# Altium schematic sheet I2C_BUS.SchDoc
size A4; SheetNumber: 2; SheetTotal: 3
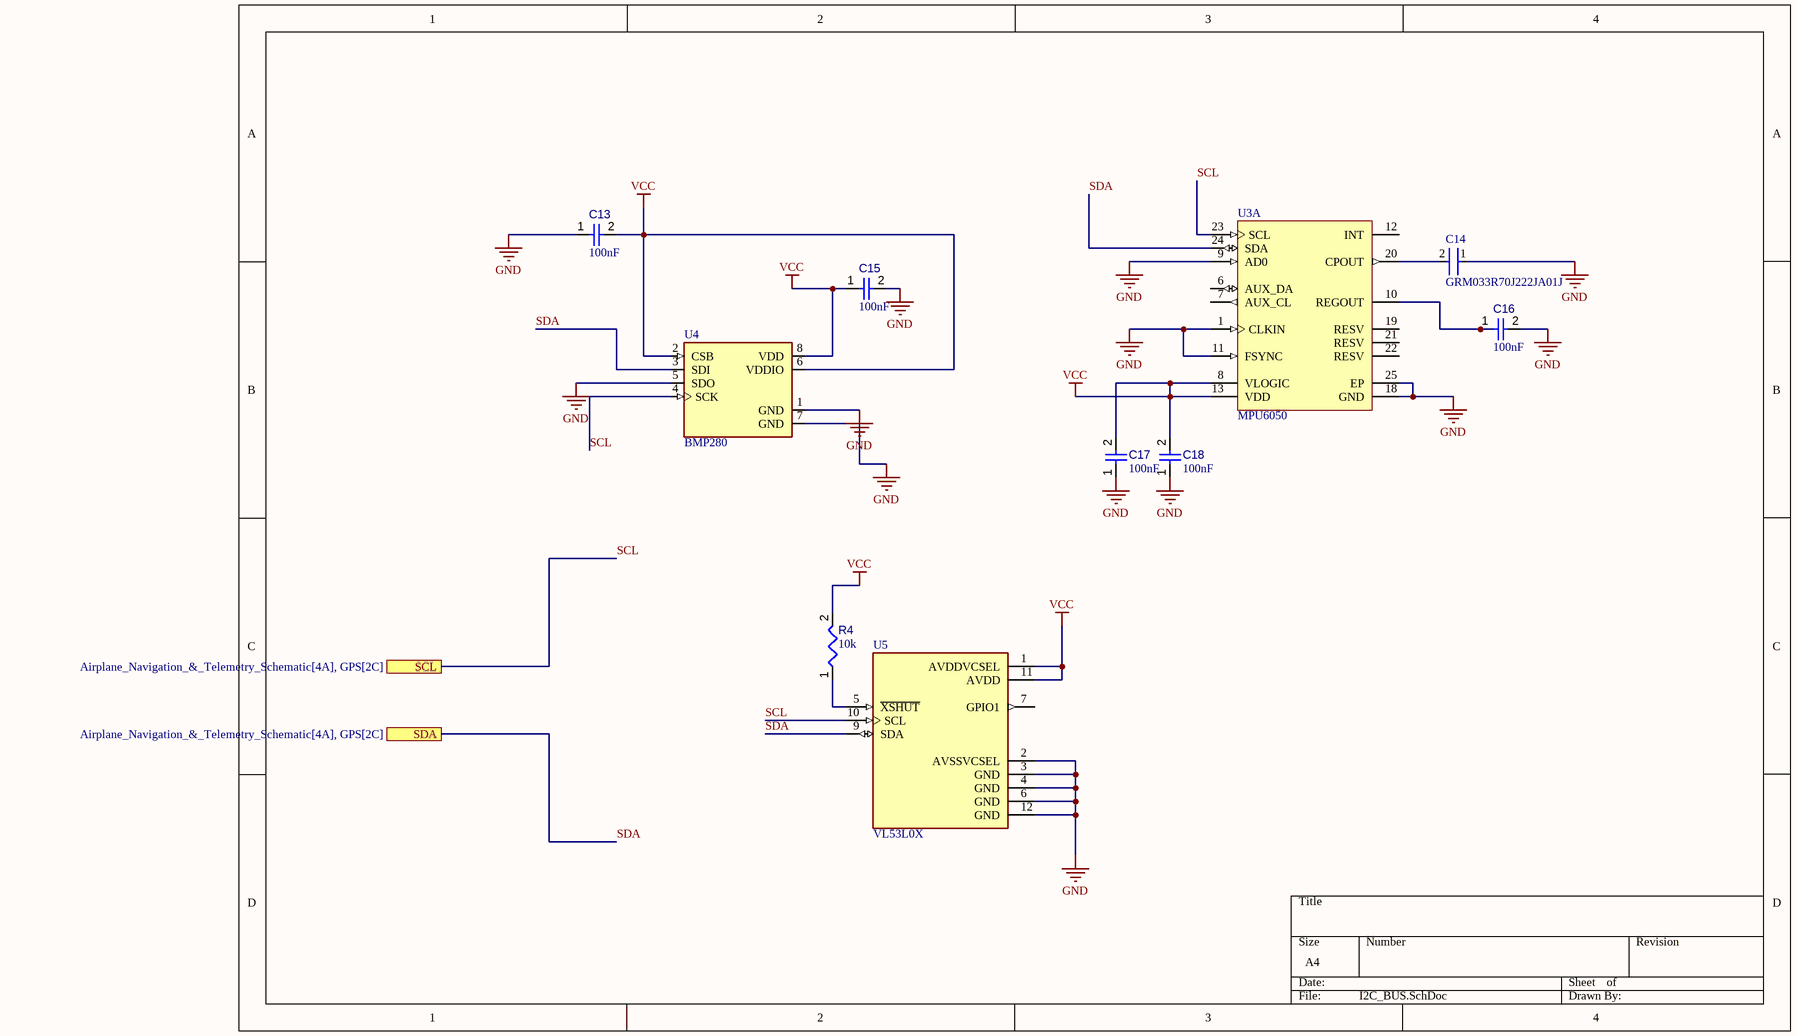
[diagram p0: I2C_BUS.SchDoc]

## Parts
C13  value 100nF  [CAPC0402(1005)60_L]  (hidden comment: Capacitor 100nF +/-20% 10V 0402)
C14  GRM033R70J222JA01J  [FP-GRM033-0_03-IPC_B]
C15  value 100nF  [CAPC0402(1005)60_L]  (hidden comment: Capacitor 100nF +/-20% 10V 0402)
C16  value 100nF  [CAPC1005X56X25LL10T15]  (hidden comment: Capacitor 0.1 uF +/- 5% 16 V 0402)
C17  value 100nF  [CAPC0402(1005)60_L]  (hidden comment: Capacitor 100nF +/-20% 10V 0402)
C18  value 100nF  [CAPC0402(1005)60_L]  (hidden comment: Capacitor 100nF +/-20% 10V 0402)
R4  value 10k  [RESC1005X40X25ML05T05]  (hidden comment: Resistor 10k +/-1% 0402 100 mW)
U3  MPU6050  [INSE-QFN-24_V]  (part A of 2)
U4  BMP280  [XDCR_BMP280]
U5  VL53L0X  [SENSOR_VL53L0X]

## Ports
SCL (see Airplane_Navigation_&_Telemetry_Schematic[4A], GPS[2C]), SDA (see Airplane_Navigation_&_Telemetry_Schematic[4A], GPS[2C])

## Nets
GND: C13.1 C14.1 C15.2 C16.2 C17.1 C18.1 U3.1(CLKIN) U3.9(AD0) U3.11(FSYNC) U3.18(GND) U3.25(EP) U4.1(GND) U4.5(SDO) U4.7(GND) U5.2(AVSSVCSEL) U5.3(GND) U5.4(GND) U5.6(GND) U5.12(GND)
VCC: C13.2 C15.1 C17.2 C18.2 R4.2 U3.8(VLOGIC) U3.13(VDD) U4.2(CSB) U4.6(VDDIO) U4.8(VDD) U5.1(AVDDVCSEL) U5.11(AVDD)
SCL: U3.23(SCL) U4.4(SCK) U5.10(SCL) ; port SCL
SDA: U3.24(SDA) U4.3(SDI) U5.9(SDA) ; port SDA
NetC14_2: C14.2 U3.20(CPOUT)
NetC16_1: C16.1 U3.10(REGOUT)
NetR4_1: R4.1 U5.5(~{XSHUT})

Not connected (* = marked no-connect by the designer): U3 6(AUX_DA) 7(AUX_CL) 12(INT) 19(RESV) 21(RESV) 22(RESV); U5 7(GPIO1)

## Library data of the parts
C13 C15 C17 C18 = CMP-001-00061-3: Chip Capacitor, 100nF +/-20%, 10V, 0402, Thickness 0.6 mm; Tolerance: 20%; Mounting Technology: SMT; Voltage Rating: 10V; Max Operating Temperature: 85°C; Pins: 2; Case/Package: 0402; Min Operating Temperature: -55°C
C14 = CMP-06035-025705-1: Chip Multilayer Ceramic Capacitors for General Purpose, 0201, 2200pF, X7R, 15%, 5%, 6.3V; Capacitance: 2.2nF; Voltage Rating (DC): 6.3V; Dielectric: X7R; Tolerance: 5%; Width: 300um; Thickness: 300um; Length: 600um
C16 = CMP-001-00001-6: Chip Capacitor, 0.1 uF, +/- 5%, 16 V, 0402 (1005 Metric); Capacitor Type: Ceramic; Voltage Rating: 16V; Max Operating Temperature: 125°C; Min Operating Temperature: -55°C; Case/Package: 0402; Mounting Technology: SM; Pins: 2; Tolerance: 5%; RoHS Compliant: True
R4 = CMP-009-00015-5: Chip Resistor, 10 KOhm, +/- 1%, 0.1 W, -55 to 155 degC, 0402 (1005 Metric); Voltage Rating: 50V; Power: 100mW; Case/Package: 0402; RoHS Compliant: True; Min Operating Temperature: -55°C; Mounting Technology: SM; Tolerance: 1%; Max Operating Temperature: 155°C; Pins: 2
U3 = CMP-010-00014-3: 3-Axis Gyroscope, 3-Axis Accelerometer, 2.375 to 3.46 V, -40 to 105 degC, 24-Pin QFN, RoHS, Tape and Reel; Manufacturer: InvenSense; Max Supply Voltage: 3.6V; Min Supply Voltage: 2.5V; Sensor Type: Motion; Interface: I2C; Min Operating Temperature: -40°C; Case/Package: QFN; Package Quantity: 5000; Pins: 24; RoHS Compliant: True; Packaging: CutTape; Datasheet URL: https://datasheet.ciiva.com/1513/1788002-1513632.pdf; Package Reference: QFN-24; Datasheet Version: Rev. 3.4, 08/2013; Package Description: 24-Pin Quad Flat No-lead Package, Body 4 x 4 mm, Pitch 0.5 mm; Max Operating Temperature: 85°C; Mounting Technology: SM
U4 = CMP-00029-00001-1: BMP280 Absolute Barometric Pressure Sensor for Battery Powered Devices 2 x 2.5mm; Value: *; Source: BMP280.SchLib; Price: None; Component Type: Standard; Availability: Unavailable; Case/Package: None; Pins: 8; MP: BMP280; Design Item ID: BMP280
U5 = CMP-013-000000-1: VL53L0X - Light, 3D Time-of-Flight _ToF_ Sensor Evaluation Board; MF: STMicroelectronics; Value: *; Pin Count: 11; MP: VL53L0X; Price: None; Availability: Unavailable; Source: SnapEDAsch.SchLib; Design Item ID: VL53L0X; SnapEDA_Link: https://www.snapeda.com/parts/VL53L0X/STMicroelectronics/view-part/473967/?ref=snap; Component Type: Standard; Package: None